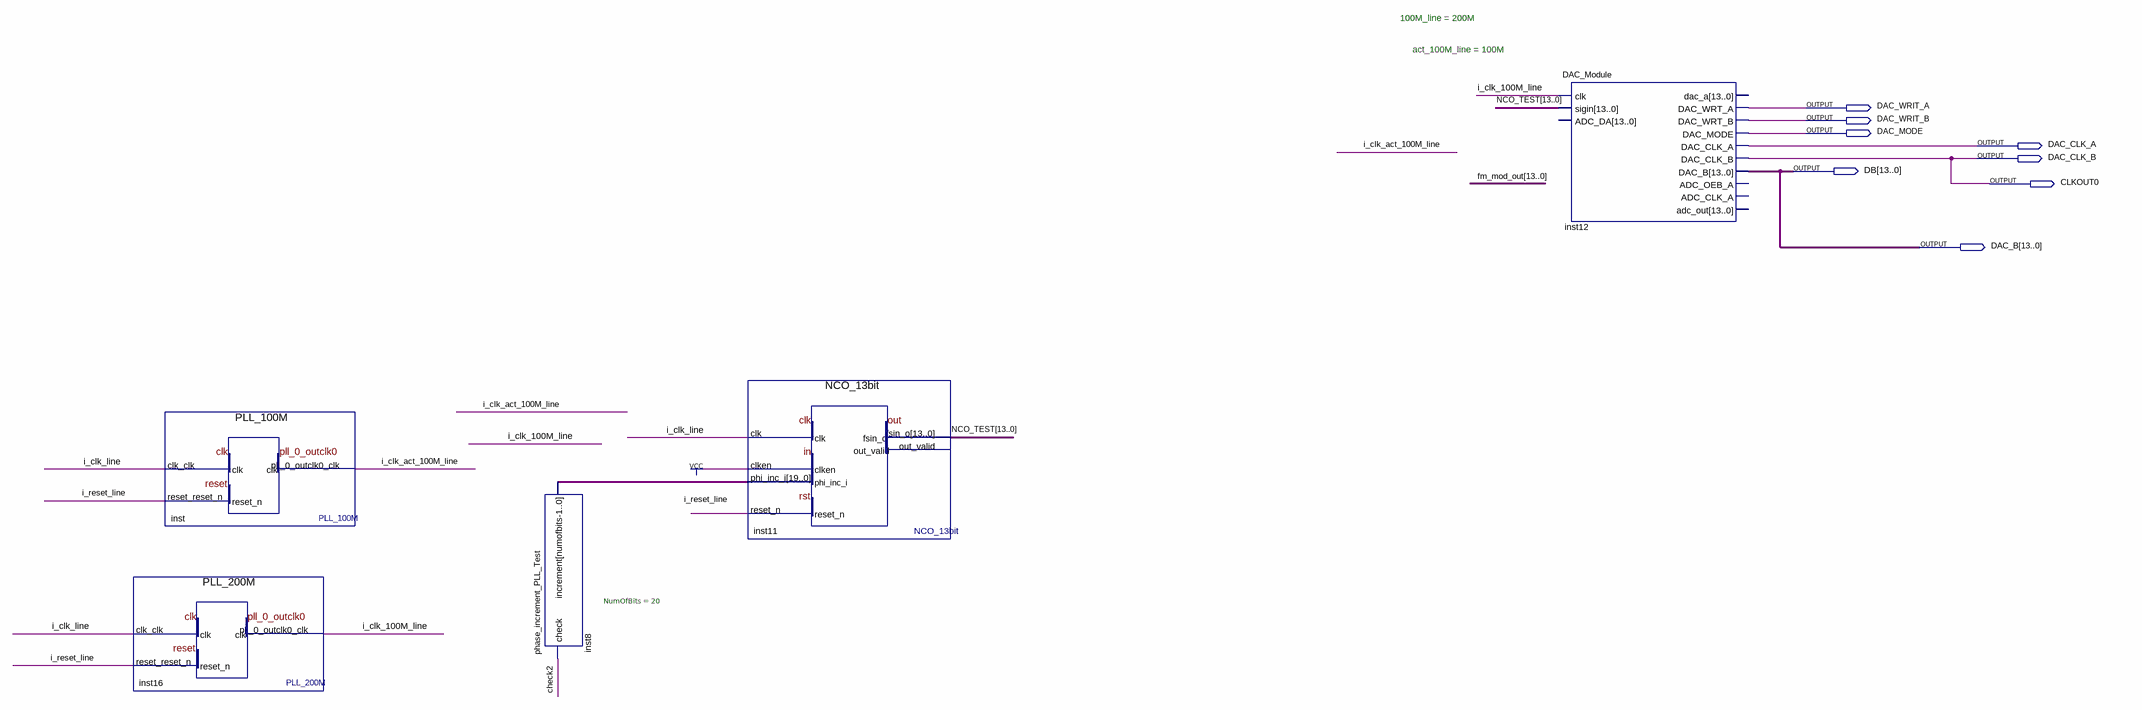
[diagram p0: schematic sheet]
// Quartus schematic DAC_Test.bdf as structural Verilog: 5 symbols, 8 pins
module DAC_Test (
  output DAC_WRIT_A,
  output DAC_WRIT_B,
  output DAC_MODE,
  output DAC_CLK_A,
  output DAC_CLK_B,
  output [13:0] DB,
  output CLKOUT0,
  output [13:0] DAC_B
);

  wire check2, i_clk_100M_line, i_clk_act_100M_line, i_clk_line, i_reset_line;
  wire [13:0] NCO_TEST;
  wire [19:0] inst8_increment;

  PLL_200M inst16 (.clk_clk(i_clk_line), .reset_reset_n(i_reset_line), .pll_0_outclk0_clk(i_clk_100M_line));
  PLL_100M inst (.clk_clk(i_clk_line), .reset_reset_n(i_reset_line), .pll_0_outclk0_clk(i_clk_act_100M_line));
  phase_increment_PLL_Test #(.NumOfBits(20)) inst8 (.check(check2), .increment(inst8_increment));
  NCO_13bit inst11 (
    .clk(i_clk_line), .clken(1'b1), .phi_inc_i(inst8_increment), .reset_n(i_reset_line), .fsin_o(NCO_TEST));  // open: out_valid
  DAC_Module inst12 (
    .clk(i_clk_100M_line), .sigin(NCO_TEST), .DAC_WRT_A(DAC_WRIT_A), .DAC_WRT_B(DAC_WRIT_B),
    .DAC_MODE(DAC_MODE), .DAC_CLK_A(DAC_CLK_A), .DAC_CLK_B(CLKOUT0), .DAC_B(DAC_B));  // open: ADC_DA, dac_a, ADC_OEB_A, ADC_CLK_A, adc_out

  assign DAC_CLK_B = CLKOUT0;
  assign DB = DAC_B;

  // Notes on the sheet:
  //   100M_line = 200M
  //   act_100M_line = 100M
endmodule
